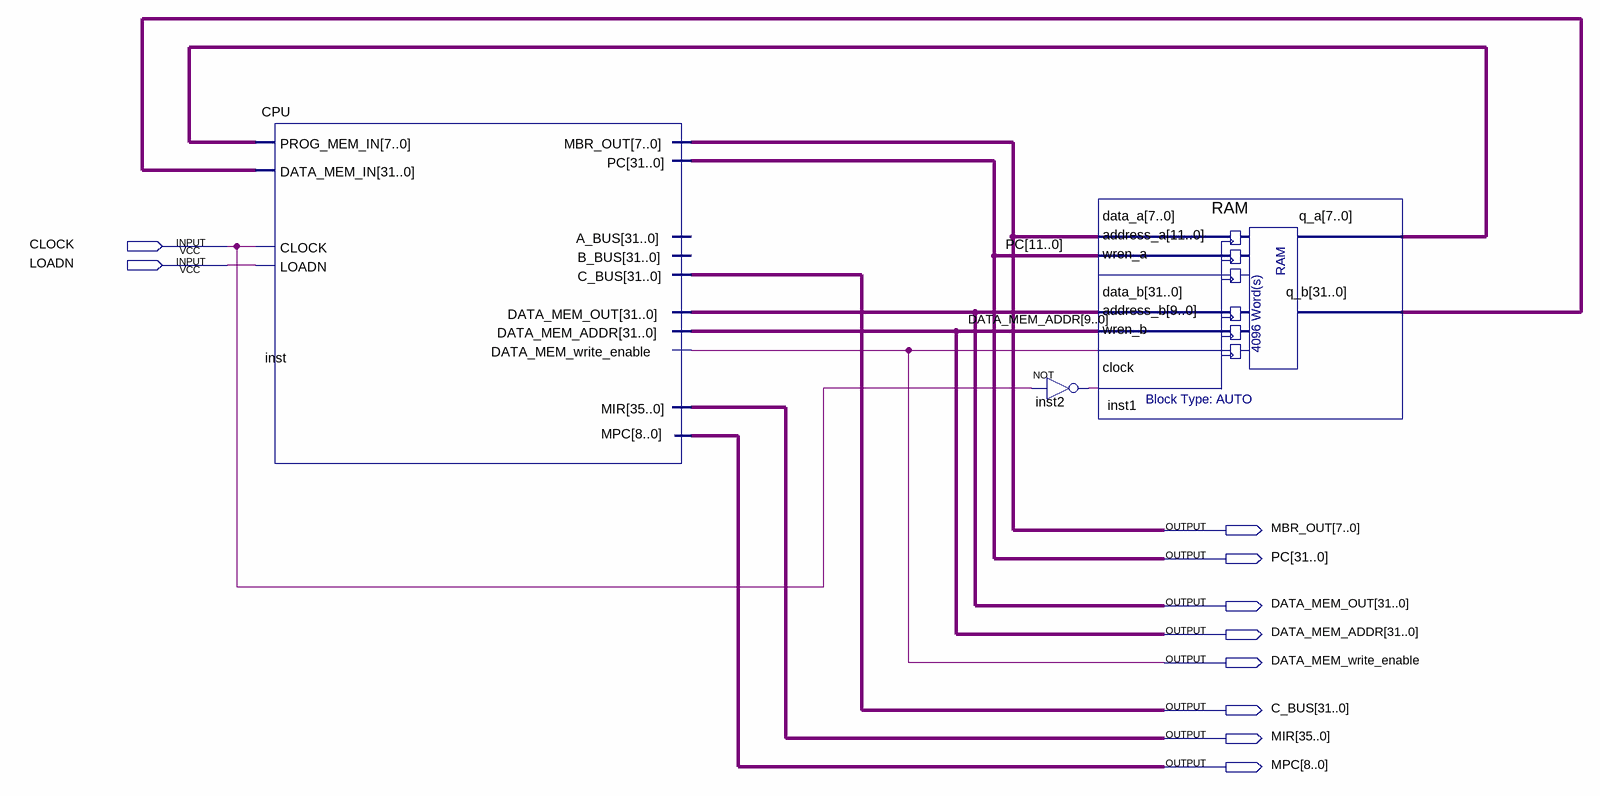
[diagram p0: schematic sheet]
// Quartus schematic MIC1.bdf as structural Verilog: 3 symbols, 10 pins
module MIC1 (
  input  CLOCK,
  input  LOADN,
  output [7:0] MBR_OUT,
  output [31:0] PC,
  output [31:0] DATA_MEM_OUT,
  output [31:0] DATA_MEM_ADDR,
  output DATA_MEM_write_enable,
  output [31:0] C_BUS,
  output [35:0] MIR,
  output [8:0] MPC
);

  wire inst2_out;
  wire [7:0] inst1_q_a;
  wire [31:0] inst1_q_b;

  CPU inst (
    .LOADN(LOADN), .CLOCK(CLOCK), .DATA_MEM_IN(inst1_q_b), .PROG_MEM_IN(inst1_q_a), .MPC(MPC), .MIR(MIR),
    .DATA_MEM_write_enable(DATA_MEM_write_enable), .DATA_MEM_ADDR(DATA_MEM_ADDR),
    .DATA_MEM_OUT(DATA_MEM_OUT), .PC(PC), .MBR_OUT(MBR_OUT), .C_BUS(C_BUS));  // open: A_BUS, B_BUS
  not inst2 (inst2_out, CLOCK);
  RAM inst1 (
    .data_a(MBR_OUT), .address_a(PC[11:0]), .data_b(DATA_MEM_OUT), .address_b(DATA_MEM_ADDR[9:0]),
    .wren_b(DATA_MEM_write_enable), .clock(inst2_out), .q_a(inst1_q_a), .q_b(inst1_q_b));  // open: wren_a
endmodule
